# Altium schematic sheet FC_Sheet2.SchDoc: SC Flight Controller
size 420 x 297 mm; Date: 07/02/2026; ApprovedBy: Barney; CheckedBy: Barney; Author: Barney; CompanyName: -; DrawnBy: Barney; Engineer: Barney; Organization: -; Address1: -; Address2: -; Address3: -; Address4: -; DocumentNumber: 2; Revision: 1; SheetNumber: 2; SheetTotal: 2; Time: 12:44
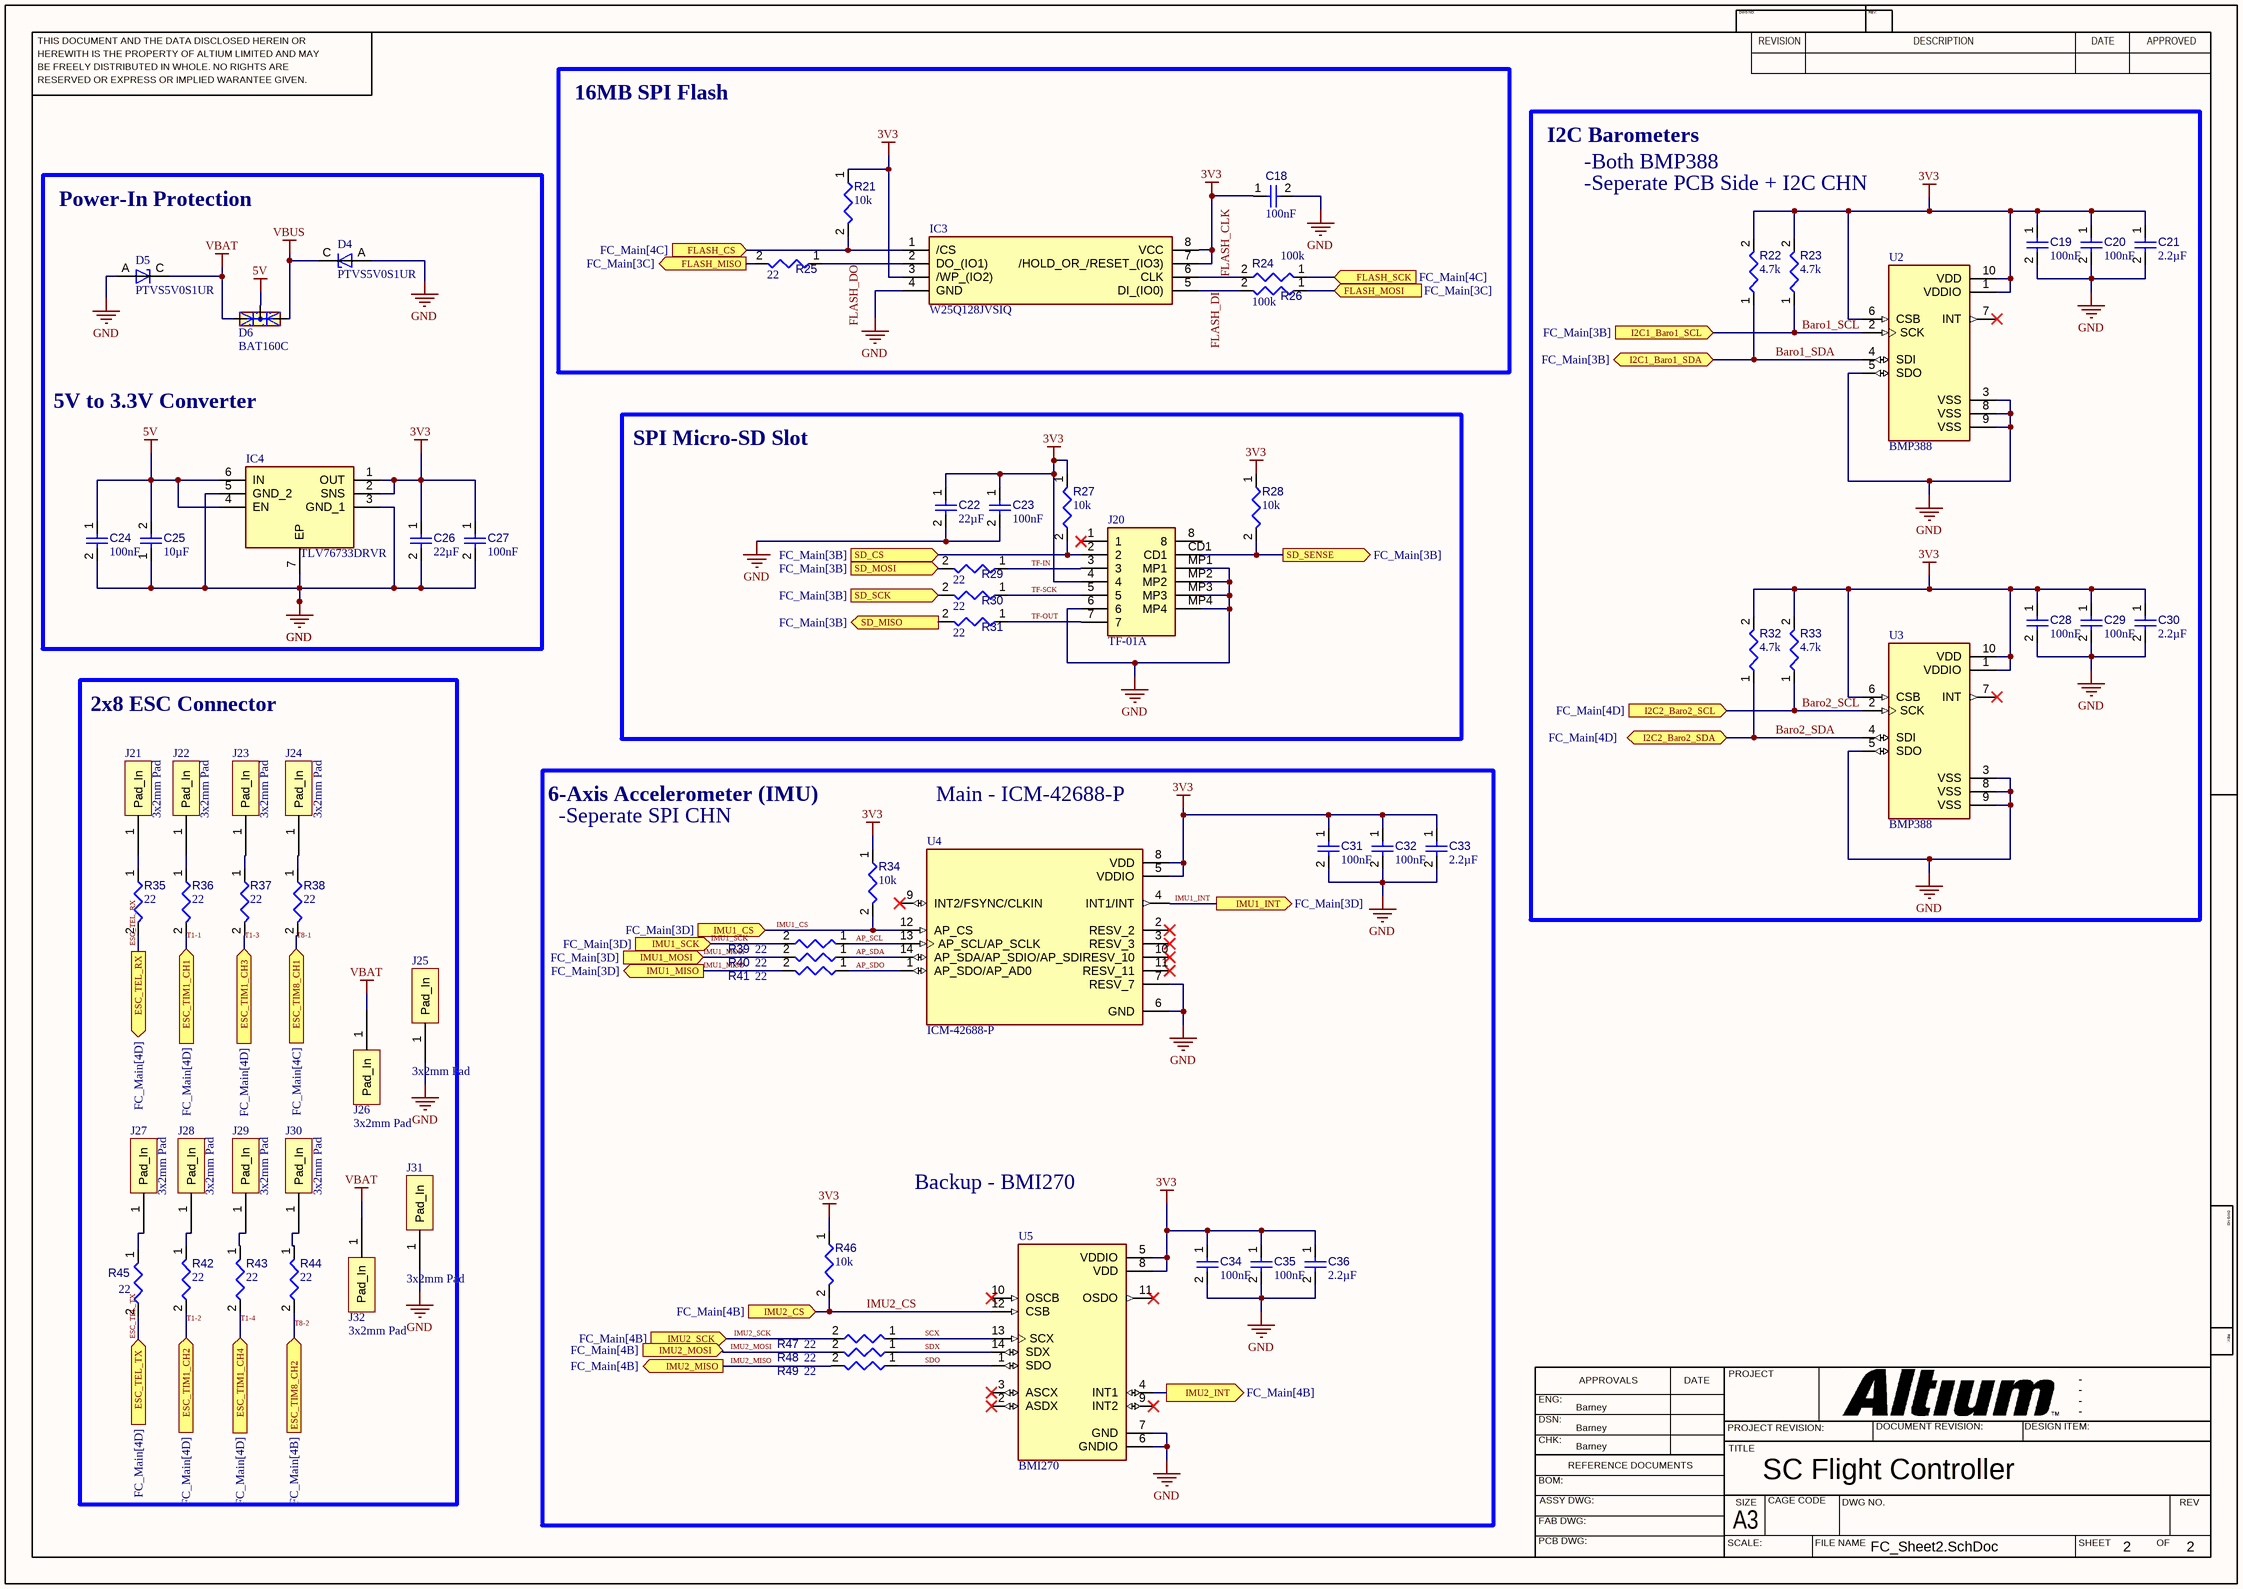
[diagram p0: FC_Sheet2.SchDoc]

## Parts
C18  value 100nF  [CAPC0402(1005)60_L]  (hidden comment: Capacitor 100nF +/-20% 10V 0402)
C19  value 100nF  [CAPC0402(1005)60_L]  (hidden comment: Capacitor 100nF +/-20% 10V 0402)
C20  value 100nF  [CAPC0402(1005)60_L]  (hidden comment: Capacitor 100nF +/-20% 10V 0402)
C21  value 2.2µF  [CAPC0402(1005)60_L]  (hidden comment: Capacitor 2,2µF +/-20% 10V 0402)
C22  value 22µF  [CAPC0805(2012)145_L]  (hidden comment: Capacitor 22µF +/-40% 16V 0805)
C23  value 100nF  [CAPC0402(1005)60_L]  (hidden comment: Capacitor 100nF +/-20% 10V 0402)
C24  value 100nF  [CAPC0402(1005)60_L]  (hidden comment: Capacitor 100nF +/-20% 10V 0402)
C25  value 10µF  [CAPC0603(1608)100_L]  (hidden comment: Capacitor 10µF +/-20% 10V 0603)
C26  value 22µF  [CAPC0805(2012)145_L]  (hidden comment: Capacitor 22µF +/-40% 16V 0805)
C27  value 100nF  [CAPC0402(1005)60_L]  (hidden comment: Capacitor 100nF +/-20% 10V 0402)
C28  value 100nF  [CAPC0402(1005)60_L]  (hidden comment: Capacitor 100nF +/-20% 10V 0402)
C29  value 100nF  [CAPC0402(1005)60_L]  (hidden comment: Capacitor 100nF +/-20% 10V 0402)
C30  value 2.2µF  [CAPC0402(1005)60_L]  (hidden comment: Capacitor 2,2µF +/-20% 10V 0402)
C31  value 100nF  [CAPC0402(1005)60_L]  (hidden comment: Capacitor 100nF +/-20% 10V 0402)
C32  value 100nF  [CAPC0402(1005)60_L]  (hidden comment: Capacitor 100nF +/-20% 10V 0402)
C33  value 2.2µF  [CAPC0402(1005)60_L]  (hidden comment: Capacitor 2,2µF +/-20% 10V 0402)
C34  value 100nF  [CAPC0402(1005)60_L]  (hidden comment: Capacitor 100nF +/-20% 10V 0402)
C35  value 100nF  [CAPC0402(1005)60_L]  (hidden comment: Capacitor 100nF +/-20% 10V 0402)
C36  value 2.2µF  [CAPC0402(1005)60_L]  (hidden comment: Capacitor 2,2µF +/-20% 10V 0402)
D4  PTVS5V0S1UR  [TVS_PTVS5V0S1UR]
D5  PTVS5V0S1UR  [TVS_PTVS5V0S1UR]
D6  BAT160C  [SOT223]
IC3  W25Q128JVSIQ  [SOIC127P790X216-8N]
IC4  TLV76733DRVR  [SON65P200X200X80-7N]
J20  TF-01A  [TF01A]
J21  3x2mm Pad  [3x2mm Pad-Footprint-1]
J22  3x2mm Pad  [3x2mm Pad-Footprint-1]
J23  3x2mm Pad  [3x2mm Pad-Footprint-1]
J24  3x2mm Pad  [3x2mm Pad-Footprint-1]
J25  3x2mm Pad  [3x2mm Pad-Footprint-1]
J26  3x2mm Pad  [3x2mm Pad-Footprint-1]
J27  3x2mm Pad  [3x2mm Pad-Footprint-1]
J28  3x2mm Pad  [3x2mm Pad-Footprint-1]
J29  3x2mm Pad  [3x2mm Pad-Footprint-1]
J30  3x2mm Pad  [3x2mm Pad-Footprint-1]
J31  3x2mm Pad  [3x2mm Pad-Footprint-1]
J32  3x2mm Pad  [3x2mm Pad-Footprint-1]
R21  value 10k  [RESC0402(1005)_L]  (hidden comment: Resistor 10K  +/-1 % 0402 63 mW)
R22  value 4.7k  [RESC0402(1005)_L]  (hidden comment: 4D7KR2F)
R23  value 4.7k  [RESC0402(1005)_L]  (hidden comment: 4D7KR2F)
R24  value 100k  [RESC0402(1005)_L]  (hidden comment: Resistor 100K +/-1 % 0402 63 mW)
R25  value 22  [RESC0402(1005)_L]  (hidden comment: Resistor 22 +/-1 % 0402 63 mW)
R26  value 100k  [RESC0402(1005)_L]  (hidden comment: Resistor 100K +/-1 % 0402 63 mW)
R27  value 10k  [RESC0402(1005)_L]  (hidden comment: Resistor 10K  +/-1 % 0402 63 mW)
R28  value 10k  [RESC0402(1005)_L]  (hidden comment: Resistor 10K  +/-1 % 0402 63 mW)
R29  value 22  [RESC0402(1005)_L]  (hidden comment: Resistor 22 +/-1 % 0402 63 mW)
R30  value 22  [RESC0402(1005)_L]  (hidden comment: Resistor 22 +/-1 % 0402 63 mW)
R31  value 22  [RESC0402(1005)_L]  (hidden comment: Resistor 22 +/-1 % 0402 63 mW)
R32  value 4.7k  [RESC0402(1005)_L]  (hidden comment: 4D7KR2F)
R33  value 4.7k  [RESC0402(1005)_L]  (hidden comment: 4D7KR2F)
R34  value 10k  [RESC0402(1005)_L]  (hidden comment: Resistor 10K  +/-1 % 0402 63 mW)
R35  value 22  [RESC0402(1005)_L]  (hidden comment: Resistor 22 +/-1 % 0402 63 mW)
R36  value 22  [RESC0402(1005)_L]  (hidden comment: Resistor 22 +/-1 % 0402 63 mW)
R37  value 22  [RESC0402(1005)_L]  (hidden comment: Resistor 22 +/-1 % 0402 63 mW)
R38  value 22  [RESC0402(1005)_L]  (hidden comment: Resistor 22 +/-1 % 0402 63 mW)
R39  value 22  [RESC0402(1005)_L]  (hidden comment: Resistor 22 +/-1 % 0402 63 mW)
R40  value 22  [RESC0402(1005)_L]  (hidden comment: Resistor 22 +/-1 % 0402 63 mW)
R41  value 22  [RESC0402(1005)_L]  (hidden comment: Resistor 22 +/-1 % 0402 63 mW)
R42  value 22  [RESC0402(1005)_L]  (hidden comment: Resistor 22 +/-1 % 0402 63 mW)
R43  value 22  [RESC0402(1005)_L]  (hidden comment: Resistor 22 +/-1 % 0402 63 mW)
R44  value 22  [RESC0402(1005)_L]  (hidden comment: Resistor 22 +/-1 % 0402 63 mW)
R45  value 22  [RESC0402(1005)_L]  (hidden comment: Resistor 22 +/-1 % 0402 63 mW)
R46  value 10k  [RESC0402(1005)_L]  (hidden comment: Resistor 10K  +/-1 % 0402 63 mW)
R47  value 22  [RESC0402(1005)_L]  (hidden comment: Resistor 22 +/-1 % 0402 63 mW)
R48  value 22  [RESC0402(1005)_L]  (hidden comment: Resistor 22 +/-1 % 0402 63 mW)
R49  value 22  [RESC0402(1005)_L]  (hidden comment: Resistor 22 +/-1 % 0402 63 mW)
U2  BMP388  [PQFN50P200X200X80-10N]
U3  BMP388  [PQFN50P200X200X80-10N]
U4  ICM-42688-P  [PQFN50P300X250X97-14N]
U5  BMI270  [XDCR_BMI270]

## Blocks framed on the sheet
16MB SPI Flash: C18 IC3 R21 R24-R26
SPI Micro-SD Slot: C22 C23 J20 R27-R31
2x8 ESC Connector: J21-J32 R35-R38 R42-R45

## Ports
ESC_TEL_RX (out, see FC_Main[4D]), ESC_TEL_TX (in, see FC_Main[4D]), ESC_TIM1_CH1 (in, see FC_Main[4D]), ESC_TIM1_CH2 (in, see FC_Main[4D]), ESC_TIM1_CH3 (in, see FC_Main[4D]), ESC_TIM1_CH4 (in, see FC_Main[4D]), ESC_TIM8_CH1 (in, see FC_Main[4C]), ESC_TIM8_CH2 (in, see FC_Main[4B]), FLASH_CS (in, see FC_Main[4C]), FLASH_MISO (out, see FC_Main[3C]), FLASH_MOSI (in, see FC_Main[3C]), FLASH_SCK (in, see FC_Main[4C]), I2C1_Baro1_SCL (in, see FC_Main[3B]), I2C1_Baro1_SDA (bidir, see FC_Main[3B]), I2C2_Baro2_SCL (in, see FC_Main[4D]), I2C2_Baro2_SDA (bidir, see FC_Main[4D]), IMU1_CS (in, see FC_Main[3D]), IMU1_INT (out, see FC_Main[3D]), IMU1_MISO (out, see FC_Main[3D]), IMU1_MOSI (in, see FC_Main[3D]), IMU1_SCK (in, see FC_Main[3D]), IMU2_CS (in, see FC_Main[4B]), IMU2_INT (out, see FC_Main[4B]), IMU2_MISO (out, see FC_Main[4B]), IMU2_MOSI (in, see FC_Main[4B]), IMU2_SCK (in, see FC_Main[4B]), SD_CS (in, see FC_Main[3B]), SD_MISO (out, see FC_Main[3B]), SD_MOSI (in, see FC_Main[3B]), SD_SCK (in, see FC_Main[3B]), SD_SENSE (out, see FC_Main[3B])

## Nets
3V3: C18.1 C19.1 C20.1 C21.1 C22.1 C23.1 C26.1 C27.1 C28.1 C29.1 C30.1 C31.1 C32.1 C33.1 C34.1 C35.1 C36.1 IC3.3(/WP_(IO2)) IC3.7(/HOLD_OR_/RESET_(IO3)) IC3.8(VCC) IC4.1(OUT) IC4.2(SNS) J20.4 R21.1 R22.2 R23.2 R27.1 R28.1 R32.2 R33.2 R34.1 R46.1 U2.1(VDDIO) U2.6(CSB) U2.10(VDD) U3.1(VDDIO) U3.6(CSB) U3.10(VDD) U4.5(VDDIO) U4.8(VDD) U5.5(VDDIO) U5.8(VDD)
5V: C24.1 C25.2 D6.4(K1K2) IC4.4(EN) IC4.6(IN)
GND: C18.2 C19.2 C20.2 C21.2 C22.2 C23.2 C24.2 C25.1 C26.2 C27.2 C28.2 C29.2 C30.2 C31.2 C32.2 C33.2 C34.2 C35.2 C36.2 D4.A D5.A IC3.4(GND) IC4.3(GND_1) IC4.5(GND_2) IC4.7(EP) J20.6 J20.MP1 J20.MP2 J20.MP3 J20.MP4 J25.1(Pad_In) J31.1(Pad_In) U2.3(VSS) U2.5(SDO) U2.8(VSS) U2.9(VSS) U3.3(VSS) U3.5(SDO) U3.8(VSS) U3.9(VSS) U4.6(GND) U4.7(RESV_7) U5.6(GNDIO) U5.7(GND)
VBAT: D5.C D6.1(A1) J26.1(Pad_In) J32.1(Pad_In)
VBUS: D4.C D6.3(A2)
AP_SCL: R39.1 U4.13(AP_SCL/AP_SCLK)
AP_SDA: R40.1 U4.14(AP_SDA/AP_SDIO/AP_SDI)
AP_SDO: R41.1 U4.1(AP_SDO/AP_AD0)
Baro1_SCL: R23.1 U2.2(SCK) ; port I2C1_Baro1_SCL
Baro1_SDA: R22.1 U2.4(SDI) ; port I2C1_Baro1_SDA
Baro2_SCL: R33.1 U3.2(SCK) ; port I2C2_Baro2_SCL
Baro2_SDA: R32.1 U3.4(SDI) ; port I2C2_Baro2_SDA
ESC_TEL_RX: R35.2 ; port ESC_TEL_RX
ESC_TEL_TX: R45.2 ; port ESC_TEL_TX
FLASH_CLK: IC3.6(CLK) R24.2
FLASH_CS: IC3.1(/CS) R21.2 ; port FLASH_CS
FLASH_DI: IC3.5(DI_(IO0)) R26.2
FLASH_DO: IC3.2(DO_(IO1)) R25.1
FLASH_MISO: R25.2 ; port FLASH_MISO
FLASH_MOSI: R26.1 ; port FLASH_MOSI
FLASH_SCK: R24.1 ; port FLASH_SCK
IMU1_CS: R34.2 U4.12(AP_CS) ; port IMU1_CS
IMU1_INT: U4.4(INT1/INT) ; port IMU1_INT
IMU1_MISO: R41.2 ; port IMU1_MISO
IMU1_MOSI: R40.2 ; port IMU1_MOSI
IMU1_SCK: R39.2 ; port IMU1_SCK
IMU2_CS: R46.2 U5.12(CSB) ; port IMU2_CS
IMU2_INT: U5.4(INT1) ; port IMU2_INT
IMU2_MISO: R49.2 ; port IMU2_MISO
IMU2_MOSI: R48.2 ; port IMU2_MOSI
IMU2_SCK: R47.2 ; port IMU2_SCK
SCX: R47.1 U5.13(SCX)
SD_CS: J20.2 R27.2 ; port SD_CS
SD_MISO: R31.2 ; port SD_MISO
SD_MOSI: R29.2 ; port SD_MOSI
SD_SCK: R30.2 ; port SD_SCK
SD_SENSE: J20.CD1 R28.2 ; port SD_SENSE
SDO: R49.1 U5.1(SDO)
SDX: R48.1 U5.14(SDX)
T1-1: R36.2 ; port ESC_TIM1_CH1
T1-2: R42.2 ; port ESC_TIM1_CH2
T1-3: R37.2 ; port ESC_TIM1_CH3
T1-4: R43.2 ; port ESC_TIM1_CH4
T8-1: R38.2 ; port ESC_TIM8_CH1
T8-2: R44.2 ; port ESC_TIM8_CH2
TF-IN: J20.3 R29.1
TF-OUT: J20.7 R31.1
TF-SCK: J20.5 R30.1
NetJ21_1: J21.1(Pad_In) R35.1
NetJ22_1: J22.1(Pad_In) R36.1
NetJ23_1: J23.1(Pad_In) R37.1
NetJ24_1: J24.1(Pad_In) R38.1
NetJ27_1: J27.1(Pad_In) R45.1
NetJ28_1: J28.1(Pad_In) R42.1
NetJ29_1: J29.1(Pad_In) R43.1
NetJ30_1: J30.1(Pad_In) R44.1

Not connected (* = marked no-connect by the designer): J20 1* 8; U2 7(INT)*; U3 7(INT)*; U4 2(RESV_2)* 3(RESV_3)* 9(INT2/FSYNC/CLKIN)* 10(RESV_10)* 11(RESV_11)*; U5 2(ASDX)* 3(ASCX)* 9(INT2)* 10(OSCB)* 11(OSDO)*

## Notes on the sheet
- I2C Barometers
- -Both BMP388
- -Seperate PCB Side + I2C CHN
- Power-In Protection
- 5V to 3.3V Converter
- 6-Axis Accelerometer (IMU)
- -Seperate SPI CHN
- Main - ICM-42688-P
- Backup - BMI270
- THIS DOCUMENT AND THE DATA DISCLOSED HEREIN OR
- HEREWITH IS THE PROPERTY OF ALTIUM LIMITED AND MAY
- DWG NO:
- REVISION
- REV:
- DESCRIPTION
- DATE
- APPROVED
- BE FREELY DISTRIBUTED IN WHOLE. NO RIGHTS ARE
- RESERVED OR EXPRESS OR IMPLIED WARANTEE GIVEN.
- ENG:
- APPROVALS
- PROJECT
- DSN:
- CHK:
- REFERENCE DOCUMENTS
- PROJECT REVISION:
- TITLE
- DOCUMENT REVISION:
- DESIGN ITEM:
- BOM:
- FAB DWG:
- PCB DWG:
- ASSY DWG:
- SCALE:
- A3
- SIZE
- CAGE CODE
- FILE NAME
- DWG NO.
- SHEET
- OF
- REV

## Library data of the parts
C18-C20 C23 C24 C27-C29 C31 C32 C34 C35 = CMP-001-00061-3: Chip Capacitor, 100nF +/-20%, 10V, 0402, Thickness 0.6 mm; Tolerance: 20%; Mounting Technology: SMT; Voltage Rating: 10V; Max Operating Temperature: 85°C; Pins: 2; Case/Package: 0402; Min Operating Temperature: -55°C
C21 C30 C33 C36 = CMP-001-00056-4: Chip Capacitor, 2,2µF +/-20%, 10V, 0402, Thickness 0.6 mm; Tolerance: 10%; Mounting Technology: SMT; Max Operating Temperature: 85°C; Case/Package: 0402; Pins: 2; Min Operating Temperature: -55°C; Voltage Rating: 10V
C22 C26 = CMP-001-00081-4: Chip Capacitor, 22µF +/-40%, 16V, 0805, Thickness 1.45 mm; Tolerance: 5%; Voltage Rating: 16V; Mounting Technology: SMT; Pins: 2; Max Operating Temperature: 85°C; Case/Package: 0805; Min Operating Temperature: -55°C
C25 = CMP-001-00075-4: Chip Capacitor, 10µF +/-20%, 10V, 0603, Thickness 1 mm; Tolerance: 10%; Voltage Rating: 10V; Max Operating Temperature: 85°C; Pins: 2; Case/Package: 0603; Mounting Technology: SMT; Min Operating Temperature: -55°C
D4 D5 = CMP-004-00031-1: 9.2V Clamp 43.5A Ipp Tvs Diode Surface Mount SOD-123W; MF: Nexperia USA; SnapEDA_Link: https://www.snapeda.com/parts/PTVS5V0S1UR/Nexperia/view-part/?ref=snap; Check_prices: https://www.snapeda.com/parts/PTVS5V0S1UR/Nexperia/view-part/?ref=eda; Design Item ID: PTVS5V0S1UR; Availability: In Stock; Value: *; Case/Package: SOD-123 Nexperia USA; Pins: 2; Price: None; Source: PTVS5V0S1UR.SchLib; Component Type: Standard; MP: PTVS5V0S1UR; Purchase-URL: https://pricing.snapeda.com/search/part/PTVS5V0S1UR/?ref=eda
D6 = CMP-004-00032-1: Diode Array 1 Pair Common Cathode Schottky 60 V 1A (DC) Surface Mount TO-261-4, TO-261AA; MF: NXP Semiconductors; SnapEDA_Link: https://www.snapeda.com/parts/BAT160C/NXP+Semiconductors/view-part/?ref=snap; Value: *; Component Type: Standard; Pins: 3; Availability: In Stock; Price: None; Source: BAT160C.SchLib; Check_prices: https://www.snapeda.com/parts/BAT160C/NXP+Semiconductors/view-part/?ref=eda; Design Item ID: BAT160C; Case/Package: TO-261-4 Nexperia USA; MP: BAT160C; Purchase-URL: https://pricing.snapeda.com/search/part/BAT160C/?ref=eda
IC3 = W25Q128JVSIQ: Integrated Circuit; Manufacturer_Name: Winbond; Datasheet Link: https://www.winbond.com/hq/search-resource-file.jsp?partNo=W25Q128JVSIQ&type=datasheet; Height: 2.16mm; Manufacturer_Part_Number: W25Q128JVSIQ; Mouser Part Number: 454-W25Q128JVSIQ; Mouser Price/Stock: https://www.mouser.co.uk/ProductDetail/Winbond/W25Q128JVSIQ?qs=qSfuJ%252Bfl%2Fd6tLXvPR4fl9w%3D%3D; Arrow Part Number: W25Q128JVSIQ; Arrow Price/Stock: https://www.arrow.com/en/products/w25q128jvsiq/winbond-electronics?utm_currency=USD&region=nac
IC4 = TLV76733DRVR: Integrated Circuit; Manufacturer_Name: Texas Instruments; Datasheet Link: http://www.ti.com/lit/gpn/TLV767; Height: 0.8mm; Manufacturer_Part_Number: TLV76733DRVR; Mouser Part Number: 595-TLV76733DRVR; Mouser Price/Stock: https://www.mouser.co.uk/ProductDetail/Texas-Instruments/TLV76733DRVR?qs=9r4v7xj2LnmGIkwTuPlHig%3D%3D; Arrow Part Number: TLV76733DRVR; Arrow Price/Stock: https://www.arrow.com/en/products/tlv76733drvr/texas-instruments?utm_currency=USD&region=europe
J20 = TF-01A: Connector; Manufacturer_Name: Korean Hroparts Elec; Datasheet Link: https://datasheet.lcsc.com/szlcsc/1903221101_Korean-Hroparts-Elec-TF-01A_C91145.pdf; Height: 1.85mm; Manufacturer_Part_Number: TF-01A
J21-J32 = CMP-002-00076-3: 3mm x 2mm Pad to solder
R21 R27 R28 R34 R46 = CMP-009-00149-3: Chip Resistor, 10 kOhms, +/-1 %, 63 mW, -55 to 125 degC, 0402; Power: 63mW; Tolerance: 1%; Min Operating Temperature: -55°C; Case/Package: 0402; Max Operating Temperature: 155°C; Pins: 2
R22 R23 R32 R33 = CMP-009-00105-2: 4K7 0.063W 1% 0402 (1005 Metric)  SMD; Power: 63mW; Mounting Technology: SMT; Case/Package: 0402; Tolerance: 1%; Pins: 2
R24 R26 = CMP-009-00168-3: Chip Resistor, 100 kOhms, +/-1 %, 63 mW, -55 to 155 degC, 0402; Tolerance: 1%; Power: 63mW; Max Operating Temperature: 155°C; Min Operating Temperature: -55°C; Pins: 2; Case/Package: 0402
R25 R29-R31 R35-R45 R47-R49 = CMP-009-00168-3: Chip Resistor, 22Ohms, +/-1 %, 63 mW, -55 to 155 degC, 0402; Tolerance: 1%; Power: 63mW; Max Operating Temperature: 155°C; Min Operating Temperature: -55°C; Pins: 2; Case/Package: 0402
U2 U3 = CMP-031-00007-1: P-Sensor SPI I2C 1, 25 Bar SMD; Design Item ID: BMP388; Price: None; Case/Package: None; MP: BMP388; Value: *; Source: BMP388.SchLib; Component Type: Standard; Pins: 10; Availability: Unavailable
U4 = CMP-021-000000-1: Accelerometer, Gyroscope, 6 Axis Sensor Output; Design Item ID: ICM-42688-P; Package: None; Value: *; Pin Count: 14; Source: ICM-42688-P.SchLib; MP: ICM-42688-P; Availability: Unavailable; Component Type: Standard; Price: None
U5 = CMP-031-00008-1: Accelerometer, Gyroscope, 6 Axis Sensor IÂ²C, SPI Output; MF: Bosch Sensortec; Source: BMI270.SchLib; Case/Package: LGA-14 Bosch Sensortec; Pins: 14; Digi-Key_Part_Number: 828-1091-2-ND; Component Type: Standard; Purchase-URL: https://pricing.snapeda.com/search/part/BMI270/?ref=eda; Value: *; Check_prices: https://www.snapeda.com/parts/BMI270/Bosch+Sensortec/view-part/?ref=eda; MP: BMI270; Design Item ID: BMI270; SnapEDA_Link: https://www.snapeda.com/parts/BMI270/Bosch+Sensortec/view-part/?ref=snap